# Altium schematic sheet power_supply.SchDoc: Watch Power Circuit
size Letter; Author: Zach Haviland; DrawnBy: Zach Haviland; DocumentNumber: 2; Revision: 1.0; SheetNumber: 2; SheetTotal: 4
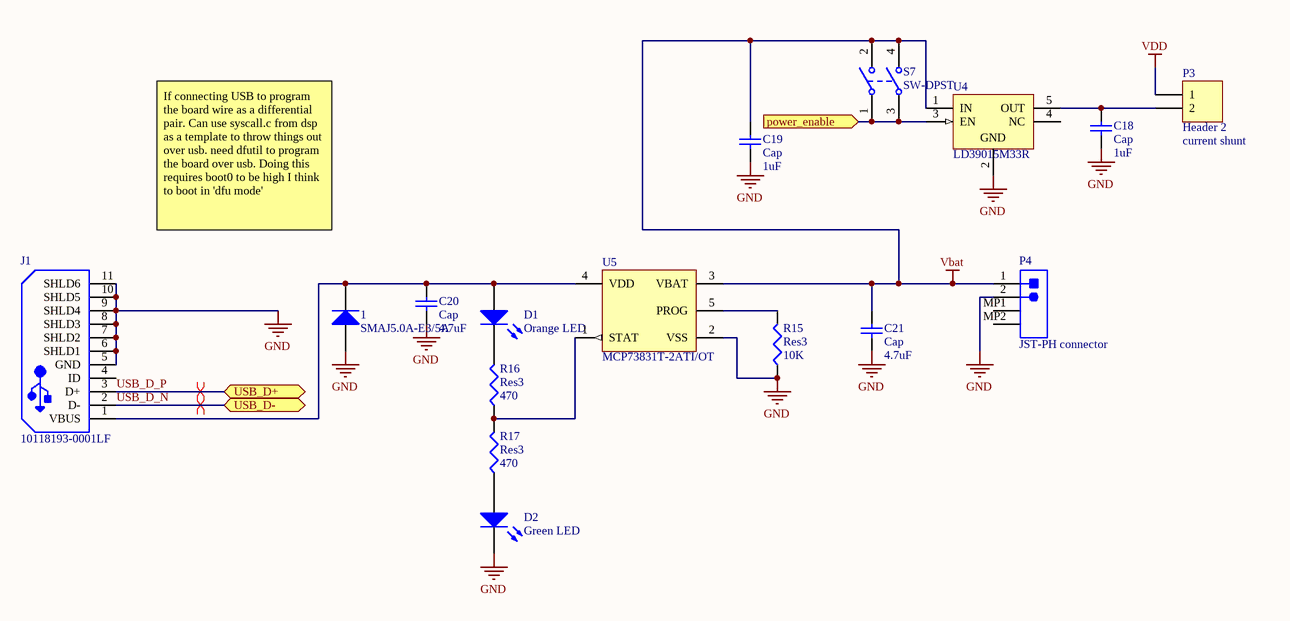
[diagram p0: power_supply.SchDoc]

## Parts
1  SMAJ5.0A-E3/5A  [VISH-DO-214AC-2_N]
C18  Cap  value 1uF  [C0805]
C19  Cap  value 1uF  [C0805]
C20  Cap  value 4.7uF  [C0805]
C21  Cap  value 4.7uF  [C0805]
D1  Orange LED  [3.2X1.6X1.1]
D2  Green LED  [3.2X1.6X1.1]
J1  10118193-0001LF  [FCI-10118193-0001LF-5_V]
P3  Header 2  [HDR1X2]
P4  JST-PH connector  [JST- S2B-PH-SM4-TB(LF)(SN)-2_V]
R15  Res3  value 10K  [1608[0603]]
R16  Res3  value 470  [1608[0603]]
R17  Res3  value 470  [1608[0603]]
S7  SW-DPST  [PCBComponent_1]
U4  LD39015M33R  [SOT23-5L_N]
U5  MCP73831T-2ATI/OT  [SOT-23-OT5_N]

## Ports
power_enable (in), USB_D+ (bidir), USB_D- (bidir)

## Nets
GND: 1.2(A) C18.1 C19.1 C20.1 C21.1 D2.2(K) J1.5(GND) J1.6(SHLD1) J1.7(SHLD2) J1.8(SHLD3) J1.9(SHLD4) J1.10(SHLD5) J1.11(SHLD6) P4.2 R15.1 U4.2(GND) U5.2(VSS)
Vbat: C19.2 C21.2 P4.1 S7.2(NO1) S7.4(NO2) U4.1(IN) U5.3(VBAT)
VDD: P3.1
power_enable: S7.1(COMMON1) S7.3(COMMON2) U4.3(EN) ; port power_enable
USB_D_N: J1.2(D-) ; port USB_D-
USB_D_P: J1.3(D+) ; port USB_D+
Net1_1: 1.1(K) C20.2 D1.1(A) J1.1(VBUS) U5.4(VDD)
NetC18_2: C18.2 P3.2 U4.5(OUT)
NetD1_2: D1.2(K) R16.2
NetD2_1: D2.1(A) R17.1
NetR15_2: R15.2 U5.5(PROG)
NetR16_1: R16.1 R17.2 U5.1(STAT)

Not connected (* = marked no-connect by the designer): J1 4(ID); P4 MP1 MP2; U4 4(NC)

## Layout directives
differential pair: USB_D_N, USB_D_P

## Notes on the sheet
- (near P3) current shunt
- If connecting USB to program the board wire as a differential pair. Can use syscall.c from dsp as a template to throw things out over usb. need dfutil to program the board over usb. Doing this requires boot0 to be high I think to boot in 'dfu mode'
- Title
- Size:
- Date:
- Letter
- Number:
- Time:
- Revision:
- Sheet
- of
- File:

## Library data of the parts
1 = CMP-0548-00320-2: Transient Voltage Suppressor, 6.40 to 231 V, 5 V Stand-off Voltage, Uni-Directional, -55 to 155 degC, 2-pin DO-214AC, Pb-Free, Tape and Reel; Manufacturer: Vishay Semiconductor; PPPM (W): 400, 300; VWM (V): 5; ID (uA): 800; IFSM: 40 A; VBR Uni-Directional (V): 6.4 to 231; PackageReference: DO-214AC-2; Operating Junction and Storage Temperature Range: -55 to 150 degC; ComponentLink1URL: http://www.vishay.com/; ComponentLink3Description: Package Specification; ComponentLink1Description: Manufacturer URL; ComponentLink2Description: Datasheet; PartNumber: SMAJ5.0A-E3/5A; RoHS: TRUE; DatasheetVersion: 12/8/2013; Packing: Tape and Reel; ComponentLink2URL: http://www.vishay.com/docs/88390/smaj50a.pdf; ComponentLink3URL: http://www.vishay.com/docs/88390/smaj50a.pdf; PackageDescription: 2-Pin DO-214AC (SMA), Body 4.245 x 2.665 mm; Mounting Technology: Surface Mount
C18-C21 = Cap: Capacitor; Published: 8-Jun-2000; LatestRevisionDate: 17-Jul-2002; LatestRevisionNote: Re-released for DXP Platform.; PackageReference: RAD-0.3; Publisher: Altium Limited; PackageDescription: Radial Cap, Thru-Hole; 2 Leads; 0.3 in Pin Spacing
D1 D2 = LED2: Typical RED, GREEN, YELLOW, AMBER GaAs LED; Published: 8-Jun-2000; LatestRevisionDate: 17-Jul-2002; LatestRevisionNote: Re-released for DXP Platform.; PackageVersion: Feb-2002; PackageReference: 3.2X1.6X1.1; Publisher: Altium Limited; PackageDescription: SM LED; 2 Flat Leads
J1 = CMP-2000-05119-1: Micro USB B Type Receptacle, -55 to 85 degC, 5-Pin SMD, RoHS, Tape and Reel; Manufacturer: FCI; Insulation Resistance: 1000MOhms; Gender: Female; Current Rating: 1.8A; Number of Contacts: 5Contact; Connector Type: MicroUSBTypeBreceptacle; Mounting Angle: Right; Datasheet Version: Rev. C, 05/2015; Packaging: Reel; Product Category: USBConnectors; Standard: USB2.0; Factory Pack Quantity: 1200; Operating Temperature Range: -55Cto+85C; Termination Style: SMD/SMT; Datasheet URL: http://datasheet.octopart.com/10118193-0001LF-FCI-datasheet-55953155.pdf; Contact Material: CopperAlloy; RoHS: Details; Contact Plating: Gold; Flammability Rating: UL94V-0; Manufacturer URL: http://www.fci.com/; Brand: FCI; Product: MicroUSBTypeBConnectors; Color: Black
P3 = Header 2: Header, 2-Pin; LatestRevisionDate: 17-Jul-2002; LatestRevisionNote: Re-released for DXP Platform.; Publisher: Altium Limited
P4 = CMP-1755-00001-1: Male Header, Pitch 2 mm, 1 x 2 Position, Height 5.5 mm, -25 to 85 degC, RoHS, Tape and Reel; Current Rating: 3 A; ComponentLink1URL: http://www.jst.com/home2.html; Radiation Hardening: No; RoHSCompliant: True; Mount: Through Hole; Contact Material: Bronze; Package Quantity: 100; Width: 2.34 mm; DatasheetVersion: Dec-12; Height: 8.13 mm; Max Operating Temperature: 105degC; ComponentLink2Description: Datasheet; Lead Pitch: 0.1 inch; Contact Finish: Lead; Packaging: Bulk; Colour: Black; Contact Plating: Tin; Min Operating Temperature: -65degC; ComponentLink1Description: Manufacturer URL; PackageReference: S2B-PH-SM4-TB(LF)(SN)-2; PackageDescription: Male Header, Pitch 2 mm, 1 x 2 Position, Height 5.5 mm; ComponentLink2URL: http://www.jst-mfg.com/product/pdf/eng/ePH.pdf; Pins: 40; Length: 101.19 mm
R15-R17 = Res3: Resistor; Published: 8-Jun-2000; LatestRevisionDate: 29-May-2009; LatestRevisionNote: IPC-7351 Footprint Added.; PackageReference: J1-0603; Publisher: Altium Limited; PackageDescription: Chip Resistor
S7 = SW-DPST: Double-Pole, Single-Throw Switch; Published: 24-Mar-1999; LatestRevisionDate: 17-Jul-2002; LatestRevisionNote: Re-released for DXP Platform.; PackageReference: DPST-4; Publisher: Altium Limited; PackageDescription: Switch; 4 Leads
U4 = CMP-0244-00351-1: 150 mA Low Quiescent Current Low Noise Voltage Regulator, 3.3V, 5-Pin SOT-23, Tape and Reel; PackageReference: SOT23-5L; ComponentLink1URL: http://www.st.com; PackageDescription: 5-Pin SOT-23 Package, 2.9 x 1.6 mm Body, 0.95 mm Pitch, 2.8 mm Lead Span; ComponentLink2Description: Datasheet; DatasheetVersion: 1/02/2009; ComponentLink1Description: Manufacturer URL; ComponentLink2URL: http://www.st.com/internet/com/TECHNICAL_RESOURCES/TECHNICAL_LITERATURE/DATASHEET/CD00173477.pdf; PackageVersion: 1/01/2008
U5 = CMP-0133-00144-1: Miniature Single-Cell, Fully Integrated Li-Ion, Li-Polymer Charge Management Controller, 4.2V, 5-Pin SOT-23, Industrial Temperature, Tape and Reel; DatasheetVersion: revE, Sep-2008; PackageVersion: revBB, Aug-2009; PackageReference: SOT-23-OT5; PackageDescription: 5-Lead Plastic Small Outline Transistor (OT) [SOT-23]; Code_IPC: SOT23-5